# EAGLE design GBCartSchematics (EAGLE 9.3.0)
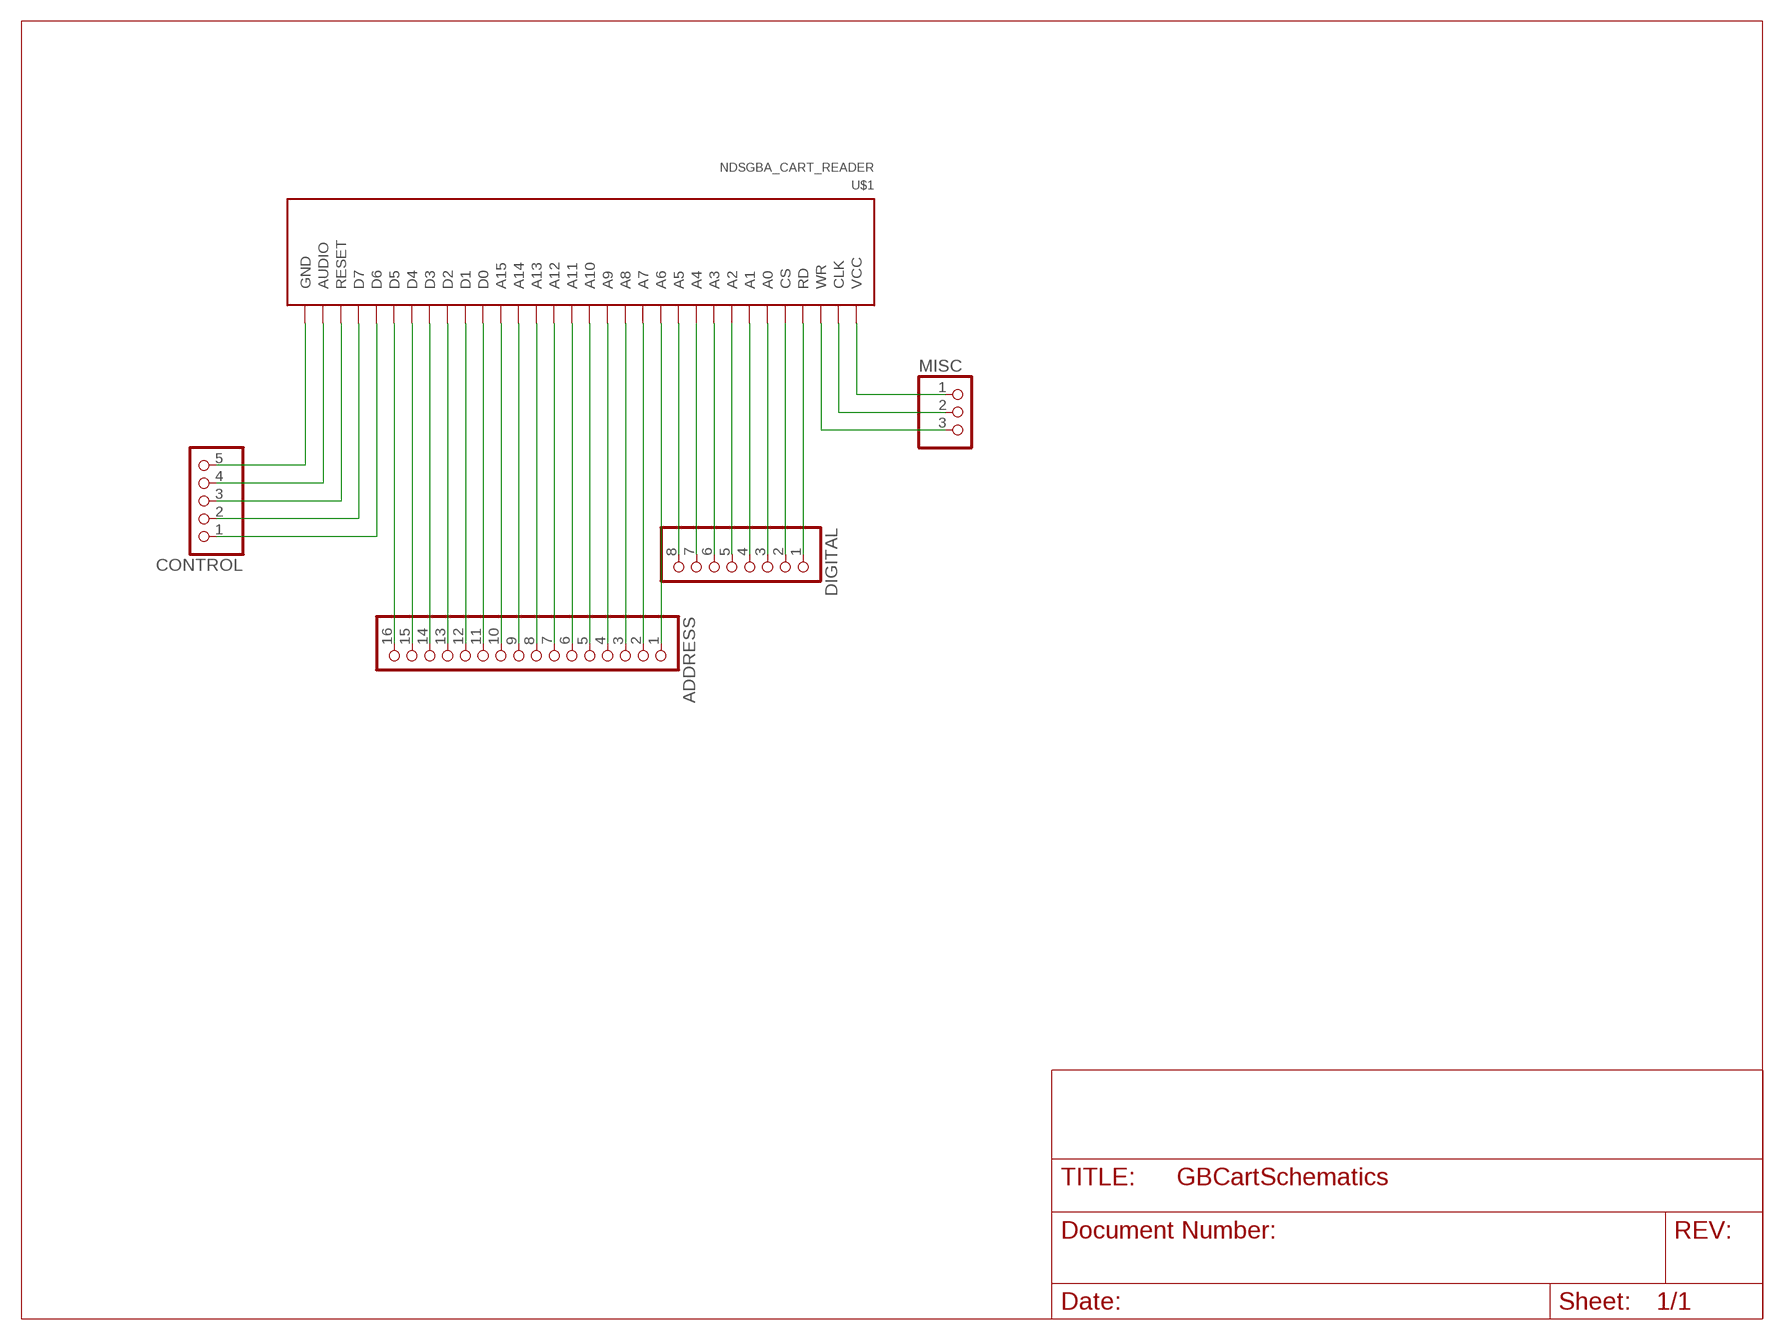
[diagram p0: schematic, sheet 1]

## Parts
ADDRESS  PINHD-1X16  [1X16]
CONTROL  PINHD-1X5  [1X05]
DIGITAL  PINHD-1X8  [1X08]
MISC  PINHD-1X3  [1X03]
U$1  NDSGBA_CART_READER  [NDSGBA_CART_READER]

## Nets
A0: ADDRESS.16 U$1.27(D5)
A1: ADDRESS.15 U$1.26(D4)
A2: ADDRESS.14 U$1.25(D3)
A3: ADDRESS.13 U$1.24(D2)
A4: ADDRESS.12 U$1.23(D1)
A5: ADDRESS.11 U$1.22(D0)
A6: ADDRESS.10 U$1.21(A15)
A7: ADDRESS.9 U$1.20(A14)
A8: ADDRESS.8 U$1.19(A13)
A9: ADDRESS.7 U$1.18(A12)
A10: ADDRESS.6 U$1.17(A11)
A11: ADDRESS.5 U$1.16(A10)
A12: ADDRESS.4 U$1.15(A9)
A13: ADDRESS.3 U$1.14(A8)
A14: ADDRESS.2 U$1.13(A7)
A15: ADDRESS.1 U$1.12(A6)
AUDIO_IN: MISC.2 U$1.2(CLK)
CLK: CONTROL.4 U$1.31(AUDIO)
CS_SRAM: CONTROL.1 U$1.28(D6)
D0: DIGITAL.8 U$1.11(A5)
D1: DIGITAL.7 U$1.10(A4)
D2: DIGITAL.6 U$1.9(A3)
D3: DIGITAL.5 U$1.8(A2)
D4: DIGITAL.4 U$1.7(A1)
D5: DIGITAL.3 U$1.6(A0)
D6: DIGITAL.2 U$1.5(CS)
D7: DIGITAL.1 U$1.4(RD)
GND [power]: MISC.1 U$1.1(VCC)
RD: CONTROL.2 U$1.29(D7)
RESET: MISC.3 U$1.3(WR)
VCC [power]: CONTROL.5 U$1.32(GND)
WR: CONTROL.3 U$1.30(RESET)

## Library data of the parts
ADDRESS = pinhead:PINHD-1X16: PIN HEADER
CONTROL = pinhead:PINHD-1X5: PIN HEADER
DIGITAL = pinhead:PINHD-1X8: PIN HEADER
MISC = pinhead:PINHD-1X3: PIN HEADER
U$1 = private:NDSGBA_CART_READER: For Nintendo DS NDSL GBA Game Cartridge / Card Reader Slot Repair Part Body Dimensions: Width: 57mm Height: 18mm Leg Dimensions: Diameter: 2mm Distance from lateral edge: 14.5mm Distance from height edge to support legs: 10.5mm Distance from height edge to solder pads: 5.5mm Depth: 1mm Distance between legs: 24mm Support legs Dimensions: Width: 4.2mm Height: 3mm Platform width: 7.8mm Solder pads dimensions: Width: 0.6mm Pad pitch: 1.5mm Distance between pads: 0.9 Height: 3mm https://www.aliexpress.com/item/For-Nintendo-DS-NDSL-GBA-Game-Cartridge-Card-Reader-Slot-Repair-Part/32679592016.html?spm=a2g0s.9042311.0.0.6e4f4c4diyf1oJ

## Net classes
0 default: width 0.127 mm, drill 0.5 mm, clearance 0.127 mm
1 power: width 0.305 mm, drill 0.5 mm, clearance 0.127 mm

## Board
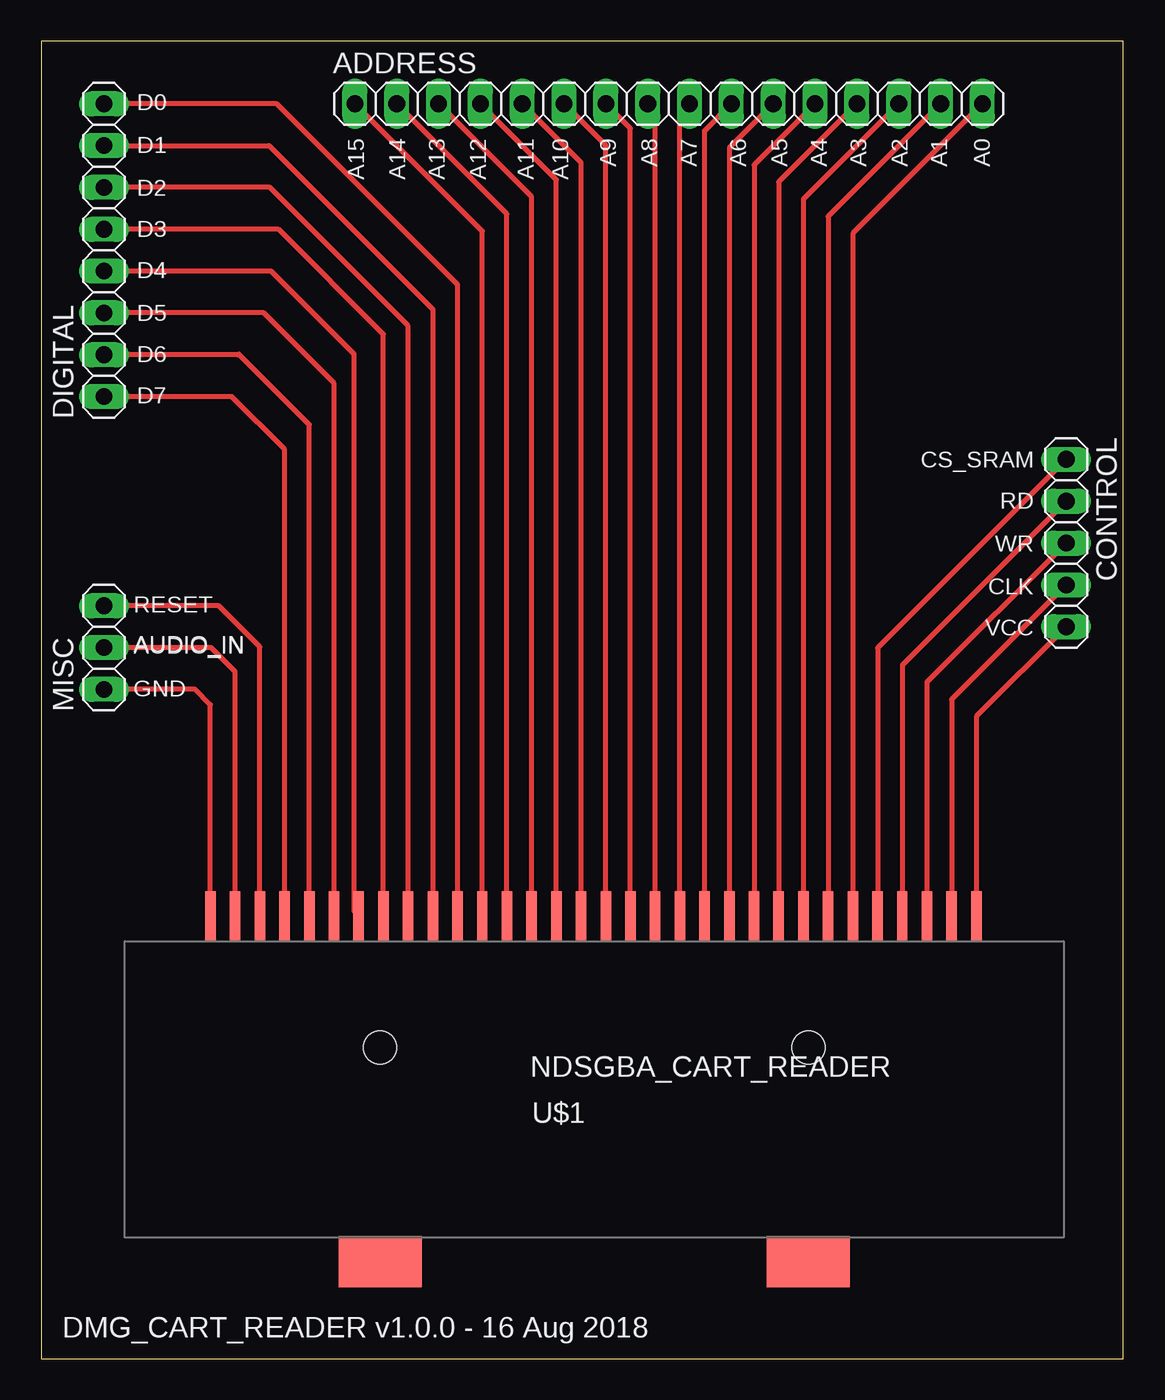
[diagram p1: board, top side]

Size 65.71 x 80 mm. Coordinates in mm from the lower left corner, seen from the top.
Outline: 0,0 65.71,0 65.71,80 0,80 0,0
Copper layers (1*16): Top 0.035mm / dielectric 1.5mm / Bottom 0.035mm
Design rules "default": minimum track width 6mil, minimum drill 0.35mm, track to track 6mil, track to pad 6mil, pad to pad 6mil, via to via 6mil, smd to smd 6mil, copper to edge 40mil, drill to drill 6mil, minimum pad ring 10mil, minimum via ring 8mil, stop-mask expansion 4mil, vias tented up to drill 0mil, thermal gap 10mil

### Footprints (pad centres in the part's own frame; a part is rotated, then mirrored left to right if it is on the bottom)
1X16 = drill 1.016 long: 1 -19.05,0; 2 -16.51,0; 3 -13.97,0; 4 -11.43,0; 5 -8.89,0; 6 -6.35,0; 7 -3.81,0; 8 -1.27,0; 9 1.27,0; 10 3.81,0; 11 6.35,0; 12 8.89,0; 13 11.43,0; 14 13.97,0; 15 16.51,0; 16 19.05,0
1X05 = drill 1.016 long: 1 -5.08,0; 2 -2.54,0; 3 0,0; 4 2.54,0; 5 5.08,0
1X08 = drill 1.016 long: 1 -8.89,0; 2 -6.35,0; 3 -3.81,0; 4 -1.27,0; 5 1.27,0; 6 3.81,0; 7 6.35,0; 8 8.89,0
1X03 = drill 1.016 long: 1 -2.54,0; 2 0,0; 3 2.54,0
NDSGBA_CART_READER = smd 0.635 x 3: 1 5.2,1.5; 2 6.7,1.5; 3 8.2,1.5; 4 9.7,1.5; 5 11.2,1.5; 6 12.7,1.5; 7 14.2,1.5; 8 15.7,1.5; 9 17.2,1.5; 10 18.7,1.5; 11 20.2,1.5; 12 21.7,1.5; 13 23.2,1.5; 14 24.7,1.5; 15 26.2,1.5; 16 27.7,1.5; 17 29.2,1.5; 18 30.7,1.5; 19 32.2,1.5; 20 33.7,1.5; 21 35.2,1.5; 22 36.7,1.5; 23 38.2,1.5; 24 39.7,1.5; 25 41.2,1.5; 26 42.7,1.5; 27 44.2,1.5; 28 45.7,1.5; 29 47.2,1.5; 30 48.7,1.5; 31 50.2,1.5; 32 51.7,1.5 | smd 5.04 x 3.1: SUP1 15.5,-19.5; SUP2 41.5,-19.5 | hole 2: 15.5,-6.5; 41.5,-6.5

### Placement (x,y rotation side)
ADDRESS  38.1,76.2 0 top
CONTROL  62.23,49.53 270 top
DIGITAL  3.81,67.31 90 top
MISC  3.81,43.18 90 top
U$1  5.08,25.4 0 top

### Tracks (layer width: path | path; a pad name or v marks a point on that pad's centre or on a via)
A0
  Top 0.305: ADDRESS.16 49.28,68.33 U$1.27
A1
  Top 0.305: ADDRESS.15 47.78,69.37 U$1.26
A2
  Top 0.305: ADDRESS.14 46.28,70.41 U$1.25
A3
  Top 0.305: ADDRESS.13 44.78,71.45 U$1.24
A4
  Top 0.305: ADDRESS.12 43.28,72.49 U$1.23
A5
  Top 0.305: ADDRESS.11 41.78,73.53 U$1.22
A6
  Top 0.305: U$1.21 40.28,74.57 ADDRESS.10
A7
  Top 0.305: U$1.20 38.78,75.61 ADDRESS.9
A8
  Top 0.305: U$1.19 37.28,75.75 ADDRESS.8
A9
  Top 0.305: U$1.18 35.78,74.71 ADDRESS.7
A10
  Top 0.305: U$1.17 34.28,73.67 ADDRESS.6
A11
  Top 0.305: U$1.16 32.78,72.63 ADDRESS.5
A12
  Top 0.305: U$1.15 31.28,71.59 ADDRESS.4
A13
  Top 0.305: U$1.14 29.78,70.55 ADDRESS.3
A14
  Top 0.305: U$1.13 28.28,69.51 ADDRESS.2
A15
  Top 0.305: U$1.12 26.78,68.47 ADDRESS.1
AUDIO_IN
  Top 0.305: U$1.2 11.78,41.72 10.32,43.18 MISC.2
CLK
  Top 0.305: CONTROL.4 55.28,40.04 U$1.31
CS_SRAM
  Top 0.305: CONTROL.1 50.78,43.16 U$1.28
D0
  Top 0.305: U$1.11 25.28,65.22 14.3,76.2 DIGITAL.8
D1
  Top 0.305: DIGITAL.7 13.84,73.66 23.78,63.72 U$1.10
D2
  Top 0.305: U$1.9 22.28,62.72 13.88,71.12 DIGITAL.6
D3
  Top 0.305: U$1.8 20.78,62.22 14.42,68.58 DIGITAL.5
D4
  Top 0.305: U$1.7 19,27.18 19,61 13.96,66.04 DIGITAL.4
D5
  Top 0.305: U$1.6 17.78,59.22 13.5,63.5 DIGITAL.3
D6
  Top 0.305: U$1.5 16.28,56.72 12,61 11.96,60.96 DIGITAL.2
D7
  Top 0.305: U$1.4 14.78,55.22 11.58,58.42 DIGITAL.1
GND
  Top 0.305: U$1.1 10.28,39.72 9.36,40.64 MISC.1
RD
  Top 0.305: CONTROL.2 52.28,42.12 U$1.29
RESET
  Top 0.305: U$1.3 13.28,43.22 10.78,45.72 MISC.3
VCC
  Top 0.305: CONTROL.5 56.78,39 U$1.32
WR
  Top 0.305: CONTROL.3 53.78,41.08 U$1.30

### Text on the board
tNames: D0 | A15 | A14 | A13 | A12 | A11 | A10 | A9 | A8 | A7 | A6 | A5 | A4 | A3 | A2 | A1 | A0 | D1 | D2 | D3 | D4 | D5 | D6 | D7 | CS_SRAM | RD | WR | CLK | RESET | VCC | AUDIO_IN | AUDIO_IN | GND | DMG_CART_READER v1.0.0 - 16 Aug 2018